# EAGLE design atmega_frequency_counter (EAGLE 7.1.0)
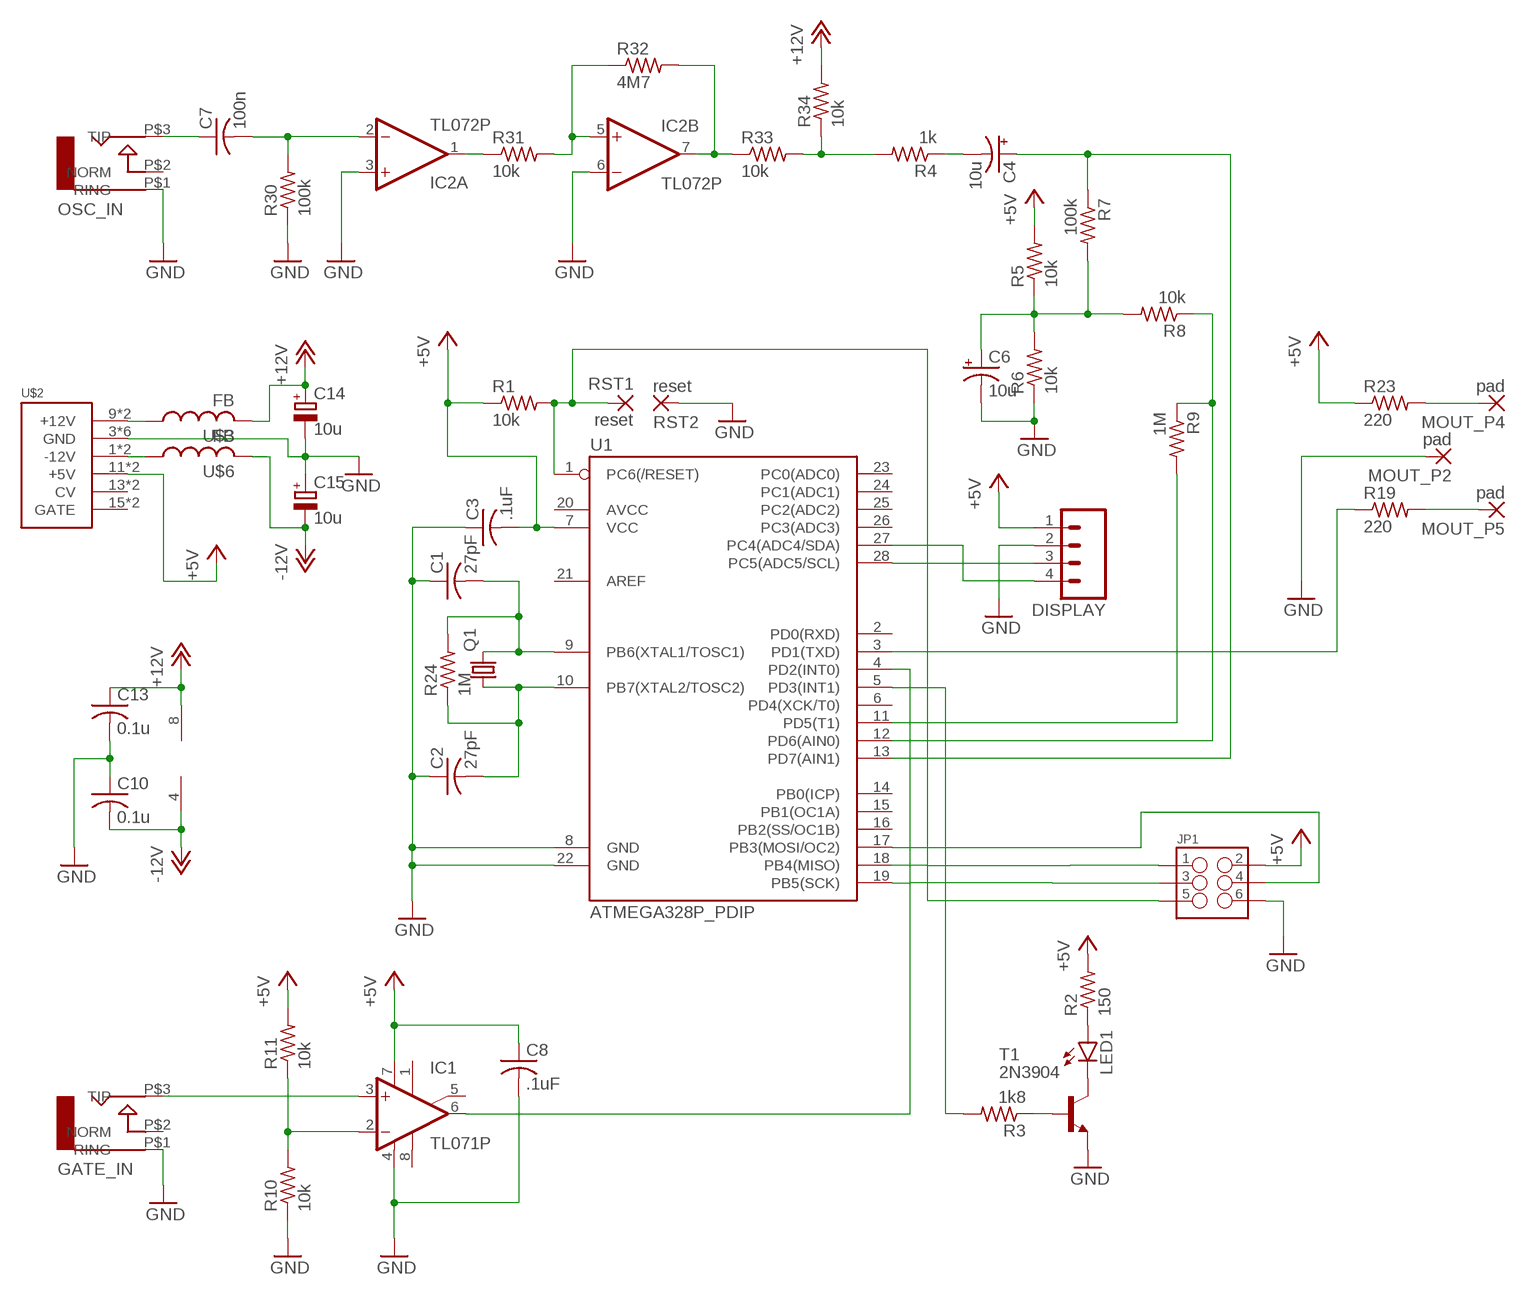
[diagram p0: schematic, sheet 1]

## Parts
C1  27pF  C-US025-040X050  [C025-040X050]
C2  27pF  C-US025-040X050  [C025-040X050]
C3  .1uF  C-US050-024X044  [C050-024X044]
C4  10u  CPOL-USB45181A  [B45181A]
C6  10u  CPOL-USB45181A  [B45181A]
C7  100n  C-US050-035X075  [C050-035X075]
C8  .1uF  C-US050-024X044  [C050-024X044]
C10  0.1u  C-US025-030X050  [C025-030X050]
C13  0.1u  C-US050-024X044  [C050-024X044]
C14  10u  CPOL-EUB45181A  [B45181A]
C15  10u  CPOL-EUB45181A  [B45181A]
DISPLAY  M04POLAR  [MOLEX-1X4]
GATE_IN  AUDIO-JACK  [ERTHENVAR-JACK-90DEG]
IC1  TL071P  [DIL08]
IC2  TL072P  [DIL08]
JP1  M03X2NO_SILK  [2X3-NS]
LED1  LED5MM  [LED5MM]
MOUT_P2  pad  2,54/0,9  [2,54/0,9]
MOUT_P4  pad  2,54/0,9  [2,54/0,9]
MOUT_P5  pad  2,54/0,9  [2,54/0,9]
OSC_IN  AUDIO-JACK  [ERTHENVAR-JACK-90DEG]
Q1  CRYSTALHC49U70  [HC49U70]
R1  10k  R-US_0207/10  [0207/10]
R2  150  R-US_0207/10  [0207/10]
R3  1k8  R-US_0207/10  [0207/10]
R4  1k  R-US_0207/10  [0207/10]
R5  10k  R-US_0207/10  [0207/10]
R6  10k  R-US_0207/10  [0207/10]
R7  100k  R-US_0207/10  [0207/10]
R8  10k  R-US_0207/10  [0207/10]
R9  1M  R-US_0207/10  [0207/10]
R10  10k  R-US_0207/10  [0207/10]
R11  10k  R-US_0207/10  [0207/10]
R19  220  R-US_0207/10  [0207/10]
R23  220  R-US_0207/10  [0207/10]
R24  1M  R-US_0207/10  [0207/10]
R30  100k  R-US_0207/10  [0207/10]
R31  10k  R-US_0207/10  [0207/10]
R32  4M7  R-US_0207/10  [0207/10]
R33  10k  R-US_0207/10  [0207/10]
R34  10k  R-US_0207/10  [0207/10]
RST1  reset  2,54/0,9  [2,54/0,9]
RST2  reset  2,54/0,9  [2,54/0,9]
T1  2N3904  [TO92]
U1  ATMEGA328P_PDIP  [DIL28-3]
U$2  POWER  [POWER_16]
U$3  FB  [FB]
U$6  FB  [FB]

## Nets
+5V: C3.2 C8.1 DISPLAY.1 IC1.7(V+) JP1.2 R1.1 R2.2 R5.2 R11.2 R23.1 U1.7(VCC) U$2.11(+5V) U$2.12(+5V)
+12V: C13.1 C14.+ IC2.8(P:V+) R34.2 U$3.P$2
-12V: C10.2 C15.- IC2.4(P:V-) U$6.P$2
GND: C1.1 C2.1 C3.1 C6.- C8.2 C10.1 C13.2 C14.- C15.+ DISPLAY.2 GATE_IN.P$1(RING) IC1.4(V-) IC2.3(A:+IN) IC2.6(B:-IN) JP1.6 MOUT_P2.1(P) OSC_IN.P$1(RING) R6.1 R10.1 R30.1 RST2.1(P) T1.3(E) U1.8(GND) U1.22(GND) U$2.3(GND) U$2.4(GND) U$2.5(GND) U$2.6(GND) U$2.7(GND) U$2.8(GND)
N$1: LED1.K(C) T1.1(C)
N$2: DISPLAY.3 U1.28(PC5(ADC5/SCL))
N$3: DISPLAY.4 U1.27(PC4(ADC4/SDA))
N$4: C1.2 Q1.2 R24.2 U1.9(PB6(XTAL1/TOSC1))
N$5: C2.2 Q1.1 R24.1 U1.10(PB7(XTAL2/TOSC2))
N$6: R3.1 T1.2(B)
N$7: R3.2 U1.5(PD3(INT1))
N$8: LED1.A R2.1
N$9: C4.- R4.1
N$10: JP1.3 U1.19(PB5(SCK))
N$11: C4.+ R7.1 U1.13(PD7(AIN1))
N$12: C6.+ R5.1 R6.2 R7.2 R8.2
N$13: IC1.2(-IN) R10.2 R11.1
N$14: R8.1 R9.1 U1.12(PD6(AIN0))
N$15: R9.2 U1.11(PD5(T1))
N$16: GATE_IN.P$3(TIP) IC1.3(+IN)
N$17: IC1.6(OUT) U1.4(PD2(INT0))
N$26: JP1.4 U1.17(PB3(MOSI/OC2))
N$34: U$2.9(+12V) U$2.10(+12V) U$3.P$1
N$37: U$2.1(-12V) U$2.2(-12V) U$6.P$1
N$43: JP1.5 R1.2 RST1.1(P) U1.1(PC6(/RESET))
N$45: JP1.1 U1.18(PB4(MISO))
N$46: MOUT_P5.1(P) R19.2
N$55: MOUT_P4.1(P) R23.2
N$56: C7.1 OSC_IN.P$3(TIP)
N$57: R19.1 U1.3(PD1(TXD))
N$58: C7.2 IC2.2(A:-IN) R30.2
N$59: IC2.1(A:OUT) R31.1
N$60: IC2.5(B:+IN) R31.2 R32.1
N$61: IC2.7(B:OUT) R32.2 R33.1
N$62: R4.2 R33.2 R34.1
Unconnected: GATE_IN.P$2(NORM) IC1.1(ON1) IC1.5(ON2) IC1.8(OPT) OSC_IN.P$2(NORM) U1.2(PD0(RXD)) U1.6(PD4(XCK/T0)) U1.14(PB0(ICP)) U1.15(PB1(OC1A)) U1.16(PB2(SS/OC1B)) U1.20(AVCC) U1.21(AREF) U1.23(PC0(ADC0)) U1.24(PC1(ADC1)) U1.25(PC2(ADC2)) U1.26(PC3(ADC3)) U$2.13(CV) U$2.14(CV) U$2.15(GATE) U$2.16(GATE)

## Library data of the parts
C1-C3 C7 C8 C10 C13 = rcl:C-US: CAPACITOR, American symbol
C4 C6 = rcl:CPOL-US: POLARIZED CAPACITOR, American symbol
C14 C15 = rcl:CPOL-EU: POLARIZED CAPACITOR, European symbol
DISPLAY = SparkFun-Connectors:M04: Header 4 Standard 4-pin 0.1" header. Use with straight break away headers (SKU : PRT-00116), right angle break away headers (PRT-00553), swiss pins (PRT-00743), machine pins (PRT-00117), and female headers (PRT-00115). Molex polarized connector foot print use with SKU : PRT-08231 with associated crimp pins and housings. 1MM SMD Version SKU: PRT-10208
GATE_IN OSC_IN = erthenvar:AUDIO-JACK: Switching Mono 3.5mm Audio Jack from Erthenvar.
IC1 = linear:TL071: OP AMP
IC2 = linear:TL072: OP AMP
JP1 = SparkFun-Connectors:M03X2: 2x3 .1" header. Shrouded, with keying- CONN-10681 SMT- CONN-11415 Pogo pins- HW-11044
LED1 = SparkFun-LED:LED: LEDs Standard schematic elements and footprints for 5mm, 3mm, 1206, and 0603 sized LEDs. 5mm - Spark Fun Electronics SKU : COM-00529 (and others)
MOUT_P2 MOUT_P4 MOUT_P5 RST1 RST2 = wirepad:2,54/0,9: THROUGH-HOLE PAD
Q1 = crystal:CRYSTAL: CRYSTAL; OC_FARNELL: unknown; OC_NEWARK: unknown
R1-R11 R19 R23 R24 R30-R34 = rcl:R-US_: RESISTOR, American symbol
T1 = transistor:2N3904: NPN TRANSISTOR
U1 = SparkFun-DigitalIC:ATMEGA328P_PDIP: uC used in the Arduino 32kb flash, 1k EEPROM, 2k SRAM This is the through-hole version of this chip.
U$2 = eurorack:POWER
U$3 U$6 = adafruit:FB: Ferrite bead Digikey #P9821BK-ND

## Net classes
1 GND: width 1.016 mm, drill 1.016 mm, clearance 0.508 mm

## Board
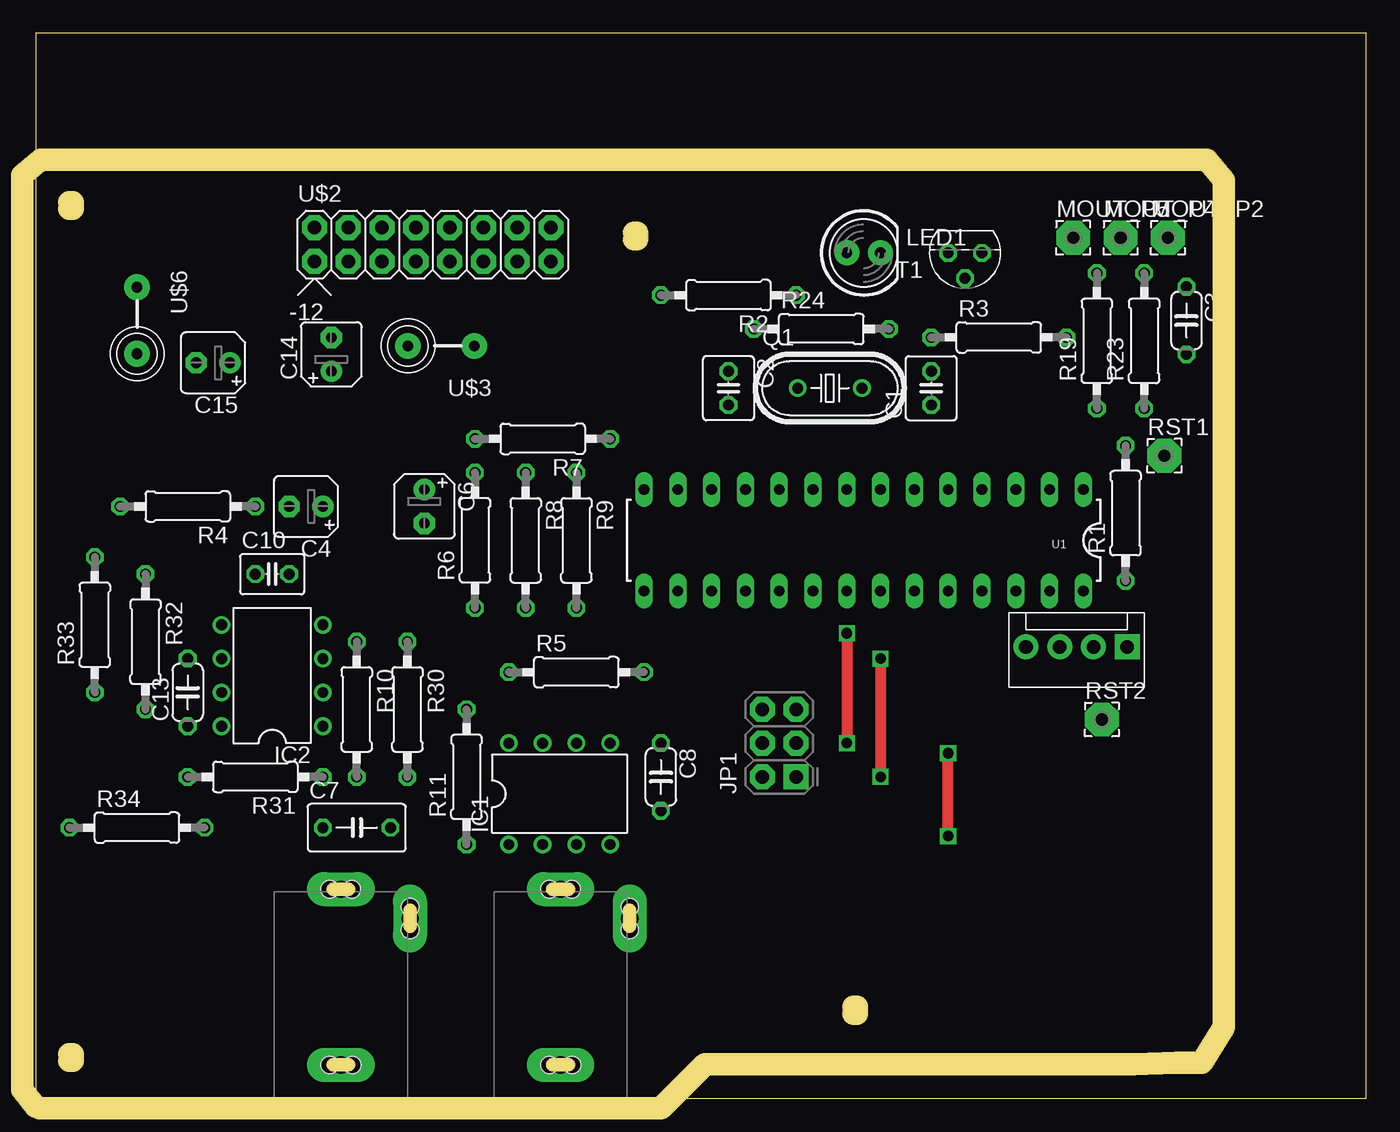
[diagram p1: board, top side]
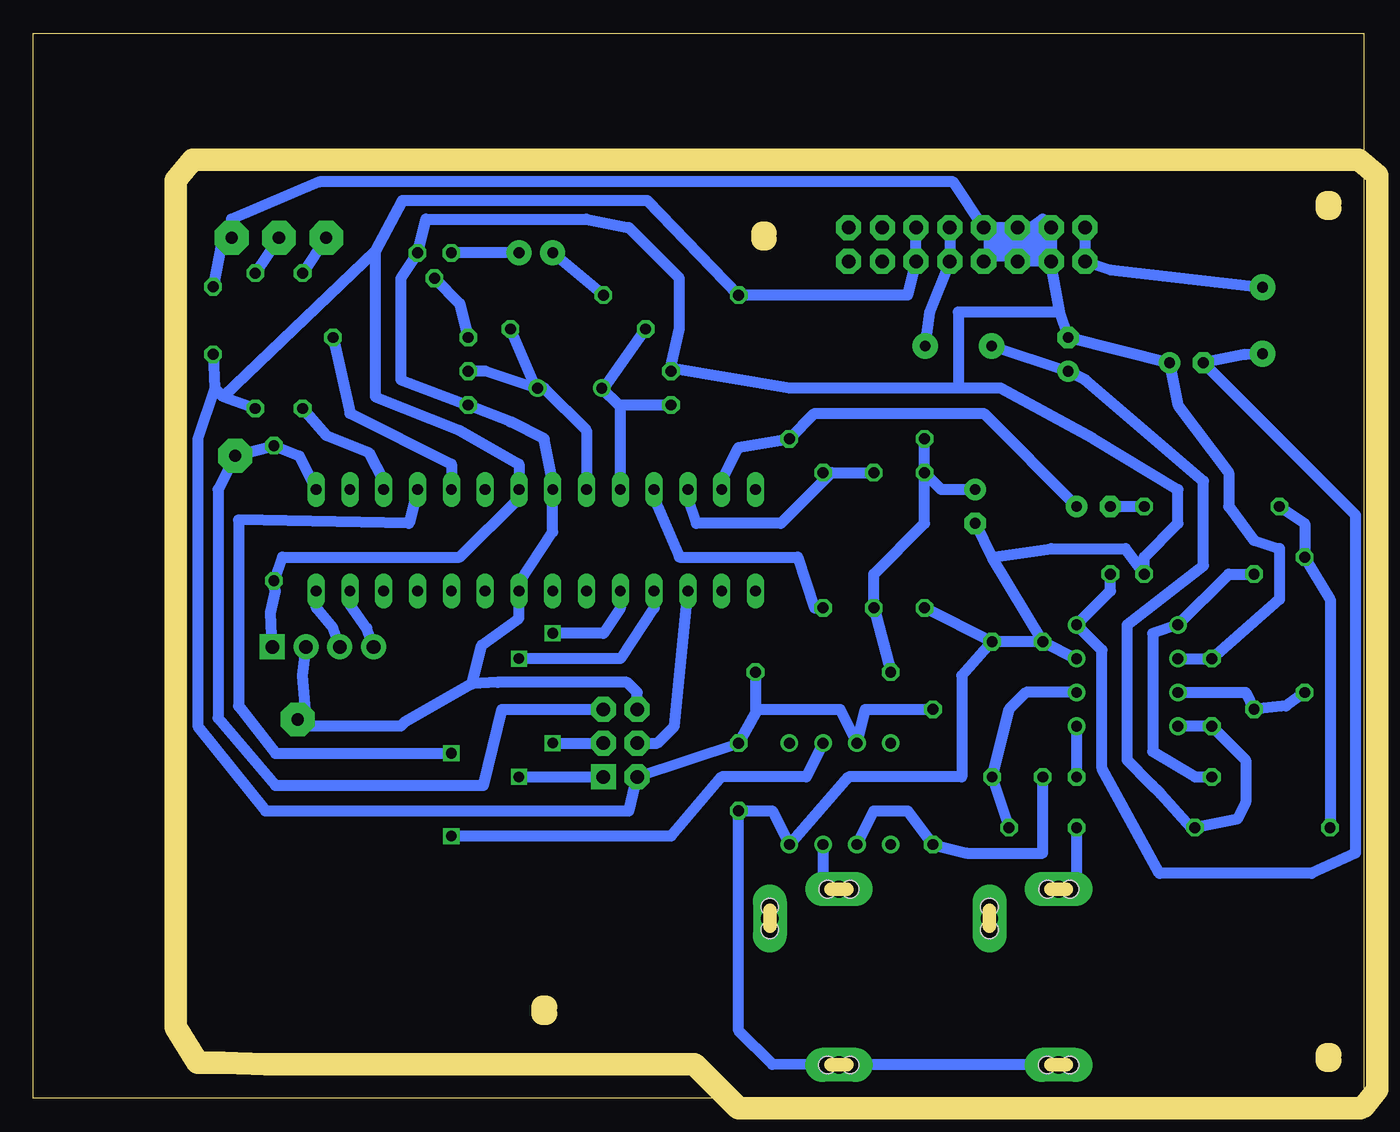
[diagram p2: board, bottom side, seen from below]

Size 100 x 80 mm. Coordinates in mm from the lower left corner, seen from the top.
Outline: 0,0 100,0 100,80 0,80 0,0
Copper layers (1*16): Top 0.035mm / dielectric 1.5mm / Bottom 0.035mm
Design rules "default *": minimum track width 32mil, minimum drill 32mil, track to track 16mil, track to pad 16mil, pad to pad 16mil, via to via 16mil, smd to smd 8mil, copper to edge 0mil, drill to drill 16mil, minimum pad ring 10mil, minimum via ring 8mil, stop-mask expansion 4mil, vias tented up to drill 0mil, thermal gap 10mil
Milling: 26 lines

### Footprints (pad centres in the part's own frame; a part is rotated, then mirrored left to right if it is on the bottom)
C025-040X050 = drill 0.813 octagon: 1 -1.27,0; 2 1.27,0
C050-024X044 = drill 0.813 octagon: 1 -2.54,0; 2 2.54,0
B45181A = drill 0.813 pad 1.6: + -1.27,0 | drill 0.813 pad 1.6 octagon: - 1.27,0
C050-035X075 = drill 0.813 octagon: 1 -2.54,0; 2 2.54,0
C025-030X050 = drill 0.813 octagon: 1 -1.27,0; 2 1.27,0
MOLEX-1X4 = drill 1.016 pad 1.88 square: 1 0,0 | drill 1.016 pad 1.88: 2 2.54,0; 3 5.08,0; 4 7.62,0
ERTHENVAR-JACK-90DEG = drill 1.3 pad 2.54 long: P$1 5,-2.5; P$2 -0.2,-13.5; P$3 5,-15.7 | hole 1.3: 5.842,-2.489; 4.14,-2.489; -0.203,-12.649; -0.203,-14.351; 5.842,-15.697; 4.166,-15.697
DIL08 = drill 0.813 pad 1.27: 1 -3.81,-3.81; 2 -1.27,-3.81; 3 1.27,-3.81; 4 3.81,-3.81; 5 3.81,3.81; 6 1.27,3.81; 7 -1.27,3.81; 8 -3.81,3.81
2X3-NS = drill 1.016 pad 1.88 square: 1 -2.54,-1.27 | drill 1.016 pad 1.88 octagon: 2 -2.54,1.27; 3 0,-1.27; 4 0,1.27; 5 2.54,-1.27; 6 2.54,1.27
LED5MM = drill 0.813 pad 1.88: A -1.27,0; K 1.27,0
2,54/0,9 = drill 0.914 pad 2.54 octagon: 1 0,0
HC49U70 = drill 0.813: 1 -2.413,0; 2 2.413,0
0207/10 = drill 0.813 octagon: 1 -5.08,0; 2 5.08,0
TO92 = drill 0.813 octagon: 1 1.27,0; 2 0,1.905; 3 -1.27,0
DIL28-3 = drill 0.813 long: 1 -16.51,-3.81; 2 -13.97,-3.81; 3 -11.43,-3.81; 4 -8.89,-3.81; 5 -6.35,-3.81; 6 -3.81,-3.81; 7 -1.27,-3.81; 8 1.27,-3.81; 9 3.81,-3.81; 10 6.35,-3.81; 11 8.89,-3.81; 12 11.43,-3.81; 13 13.97,-3.81; 14 16.51,-3.81; 15 16.51,3.81; 16 13.97,3.81; 17 11.43,3.81; 18 8.89,3.81; 19 6.35,3.81; 20 3.81,3.81; 21 1.27,3.81; 22 -1.27,3.81; 23 -3.81,3.81; 24 -6.35,3.81; 25 -8.89,3.81; 26 -11.43,3.81; 27 -13.97,3.81; 28 -16.51,3.81
POWER_16 = drill 1.016 pad 1.88 octagon: 1 -6.35,-1.27; 2 -6.35,1.27; 3 -3.81,-1.27; 4 -3.81,1.27; 5 -1.27,-1.27; 6 -1.27,1.27; 7 1.27,-1.27; 8 1.27,1.27; 9 3.81,-1.27; 10 3.81,1.27; 11 6.35,-1.27; 12 6.35,1.27; 13 8.89,-1.27; 14 8.89,1.27; 15 11.43,-1.27; 16 11.43,1.27
FB = drill 0.8 pad 1.93: P$1 -2.5,0; P$2 2.5,0

### Placement (x,y rotation side)
C1  67.31,53.34 90 top
C2  52.07,53.34 270 top
C3  86.49,58.42 270 top
C4  20.32,44.45 180 top
C6  29.21,44.45 270 top
C7  24.13,20.32 0 top
C8  46.99,24.13 270 top
C10  17.78,39.37 0 top
C13  11.43,30.48 90 top
C14  22.23,55.88 90 top
C15  13.34,55.24 180 top
DISPLAY  82.04,33.91 180 top
GATE_IN  44.45,0 180 top
IC1  39.37,22.86 0 top
IC2  17.78,31.75 90 top
JP1  55.88,26.67 90 top
LED1  62.23,63.5 0 top
MOUT_P2  85.09,64.64 0 top
MOUT_P4  81.53,64.64 0 top
MOUT_P5  77.98,64.64 0 top
OSC_IN  27.94,0 180 top
Q1  59.69,53.34 0 top
R1  81.92,43.94 90 top
R2  52.07,60.33 180 top
R3  72.39,57.15 0 top
R4  11.43,44.45 180 top
R5  40.64,32 0 top
R6  33.02,41.91 90 top
R7  38.1,49.53 180 top
R8  36.83,41.91 270 top
R9  40.64,41.91 270 top
R10  24.13,29.21 270 top
R11  32.38,24.13 90 top
R19  79.76,56.9 90 top
R23  83.31,56.9 90 top
R24  59.05,57.78 0 top
R30  27.94,29.21 270 top
R31  16.51,24.13 180 top
R32  8.26,34.29 270 top
R33  4.45,35.56 90 top
R34  7.62,20.32 0 top
RST1  84.84,48.26 0 top
RST2  80.14,28.45 0 top
T1  69.85,63.5 180 top
U1  62.23,41.91 180 top
U$2  27.3,64.14 0 top
U$3  30.48,56.52 180 top
U$6  7.62,58.42 270 top

### Tracks (layer width: path | path; a pad name or v marks a point on that pad's centre or on a via)
+5V
  Bottom 0.813: R11.2 37.47,29.21 IC1.7 39.37,29.21 45.72,29.21 | R5.2 45.72,29.21 | 45.72,29.21 45.72,28.96 C8.1 JP1.2 55.24,21.59 82.55,21.59 87.63,27.94 87.63,49.53 86.36,53.34 | C3.2 86.36,53.34 | 86.36,53.34 85.72,52.7 | 85.72,52.7 R23.1 | U$2.12 U$2.11 34.29,60.33 R2.2 53.85,67.44 72.26,67.44 74.3,63.63 | 74.3,63.63 85.72,52.7 | 74.3,63.63 74.3,52.7 67.94,50.16 63.5,47.62 U1.7 63.5,45.09 67.94,40.64 81.28,40.64 R1.1 82.04,38.73 81.79,38.1 82.17,36.45 DISPLAY.1
+12V
  Bottom 0.813: U$3.P$2 C14.+ 20.95,53.98 12.06,46.35 12.06,40.01 17.78,35.56 17.78,25.4 15.99,23.58 | IC2.8 C13.1 8.89,25.4 8.89,22.23 9.53,20.95 R34.2 12.95,20.32 15.27,22.86 15.99,23.58 | 15.88,23.5 15.99,23.58
-12V
  Bottom 0.813: C10.2 19.05,38.1 IC2.4 19.68,33.66 19.68,24.77 15.37,16.89 3.94,16.89 0.64,18.41 0.64,43.81 C15.- 8.89,55.88 U$6.P$2
GND
  Bottom 0.813: R10.1 IC2.3 | C6.- 27.94,40.64 | 27.94,40.64 23.5,41.27 17.91,41.27 C10.1 16.51,40.64 13.97,43.18 13.97,45.72 20.32,49.53 27.3,53.34 30.48,53.34 | 27.94,40.64 R10.1 | C3.1 85.85,64.26 MOUT_P2.1 85.09,66.04 78.49,68.83 30.86,68.83 U$2.8 U$2.6 U$2.4 U$2.3 U$2.5 24.13,66.04 | 24.13,66.04 U$2.7 | IC2.6 C13.2 6.35,37.47 6.35,41.27 8.26,41.91 10.16,44.45 10.16,46.99 13.97,52.07 C15.+ C14.- 22.86,59.05 | 22.86,59.05 24.13,66.04 | 52.1,54.82 43.18,53.34 30.48,53.34 | 52.1,54.82 51.44,57.78 51.44,61.59 55.24,65.41 58.42,66.04 70.48,66.04 T1.3 72.39,61.59 72.39,53.98 C1.1 64.14,50.8 61.59,49.53 60.96,46.35 U1.8 60.96,42.55 63.5,38.73 U1.22 63.5,36.07 66.29,34.04 67.01,31.12 | 30.48,53.34 30.48,59.05 22.86,59.05 | OSC_IN.P$1 GATE_IN.P$1 40.6,2.5 44.45,2.54 46.99,5.08 C8.2 44.45,21.59 IC1.4 38.73,24.13 30.23,24.13 30.23,31.75 R30.1 | C2.1 52.31,54.61 52.1,54.82 | R10.1 R30.1 | R30.1 R6.1 | DISPLAY.2 79.76,31.75 79.5,28.7 RST2.1 79.63,27.94 72.39,27.94 72.09,28.24 67.01,31.12 | JP1.6 54.61,30.48 55.37,31.24 65.09,31.24 67.01,31.12
N$1
  Bottom 0.813: LED1.K T1.1
N$2
  Bottom 0.813: DISPLAY.3 77.47,35.31 78.74,36.83 U1.28
N$3
  Bottom 0.813: DISPLAY.4 74.93,35.31 76.2,37.08 U1.27
N$4
  Bottom 0.813: U1.9 58.42,50.16 61.59,53.34 Q1.2 62.23,53.34 | C1.2 66.04,54.61 62.23,53.34 | 62.23,53.34 R24.2
N$5
  Bottom 0.813: R24.1 57.15,53.34 Q1.1 55.94,52.01 | U1.10 55.88,51.94 55.94,52.01 | C2.2 55.88,52.07 55.94,52.01
N$6
  Bottom 0.813: R3.1 67.94,59.69 T1.2
N$7
  Bottom 0.813: U1.5 68.58,47.62 76.2,51.44 R3.2
N$8
  Bottom 0.813: LED1.A R2.1
N$9
  Bottom 0.813: C4.- R4.1
N$10  (via drill 0.8)
  Top 0.813: v60.96,34.92 v60.96,26.67
  Bottom 0.813: U1.19 55.88,36.83 57.15,34.92 v60.96,34.92 | v60.96,26.67 JP1.3
N$11
  Bottom 0.813: U1.13 48.26,46.35 46.99,48.9 R7.1 41.27,51.44 28.57,51.44 C4.+
N$12
  Bottom 0.813: R5.1 R8.2 36.83,39.37 33.02,43.18 R6.2 | C6.+ 31.75,45.72 R6.2 | R6.2 R7.2
N$13
  Bottom 0.813: IC1.2 36.83,21.59 34.29,21.59 R11.1 29.84,18.41 24.13,18.41 R10.2
N$14
  Bottom 0.813: R9.1 40.01,46.99 | 40.01,46.99 R8.1 | U1.12 50.8,45.09 50.16,43.18 43.81,43.18 40.01,46.99
N$15
  Bottom 0.813: R9.2 41.27,36.83 42.55,40.64 51.44,40.64 53.34,45.09 U1.11
N$16
  Bottom 0.813: IC1.3 40.64,15.24 38.64,15.24 GATE_IN.P$3
N$17  (via drill 0.8)
  Top 0.813: v68.58,19.68 v68.58,25.91
  Bottom 0.813: U1.4 71.75,43.18 84.58,43.43 84.58,29.46 81.79,25.91 v68.58,25.91 | IC1.6 41.91,24.13 48.26,24.13 52.07,19.68 v68.58,19.68
N$26
  Bottom 0.813: JP1.4 53.09,26.67 51.82,27.94 U1.17
N$34
  Bottom 0.813: U$2.10 U$2.9 32.64,59.05 U$3.P$1
N$37
  Bottom 0.813: U$2.2 U$2.1 19.05,62.23 U$6.P$1
N$43
  Bottom 0.813: U1.1 80.01,48.26 R1.2 RST1.1 86.11,45.72 86.11,28.57 81.79,23.5 66.17,23.5 64.77,29.21 JP1.5
N$45  (via drill 0.8)
  Top 0.813: v63.5,33.02 v63.5,24.13
  Bottom 0.813: U1.18 53.34,36.83 55.88,33.02 v63.5,33.02 | v63.5,24.13 JP1.1
N$46
  Bottom 0.813: MOUT_P5.1 R19.2
N$55
  Bottom 0.813: MOUT_P4.1 R23.2
N$56
  Bottom 0.813: C7.1 21.59,15.78 OSC_IN.P$3
N$57
  Bottom 0.813: U1.3 73.66,46.35 74.8,48.51 77.98,49.78 R19.1
N$58
  Bottom 0.813: C7.2 R30.2 26.67,29.21 25.4,30.48 IC2.2
N$59
  Bottom 0.813: IC2.1 R31.1
N$60
  Bottom 0.813: R31.2 12.7,24.13 15.88,26.04 15.88,34.92 IC2.5 10.16,39.37 R32.1
N$61
  Bottom 0.813: R33.1 5.84,29.46 R32.2 8.89,30.48 IC2.7
N$62
  Bottom 0.813: R4.2 4.45,43.18 R33.2 2.54,37.47 R34.1
(copper drawn outside any net)
  shapes: Bottom area x1